# Altium project МПСУ.464421.22-01.PrjPcb (part 1 of 2)
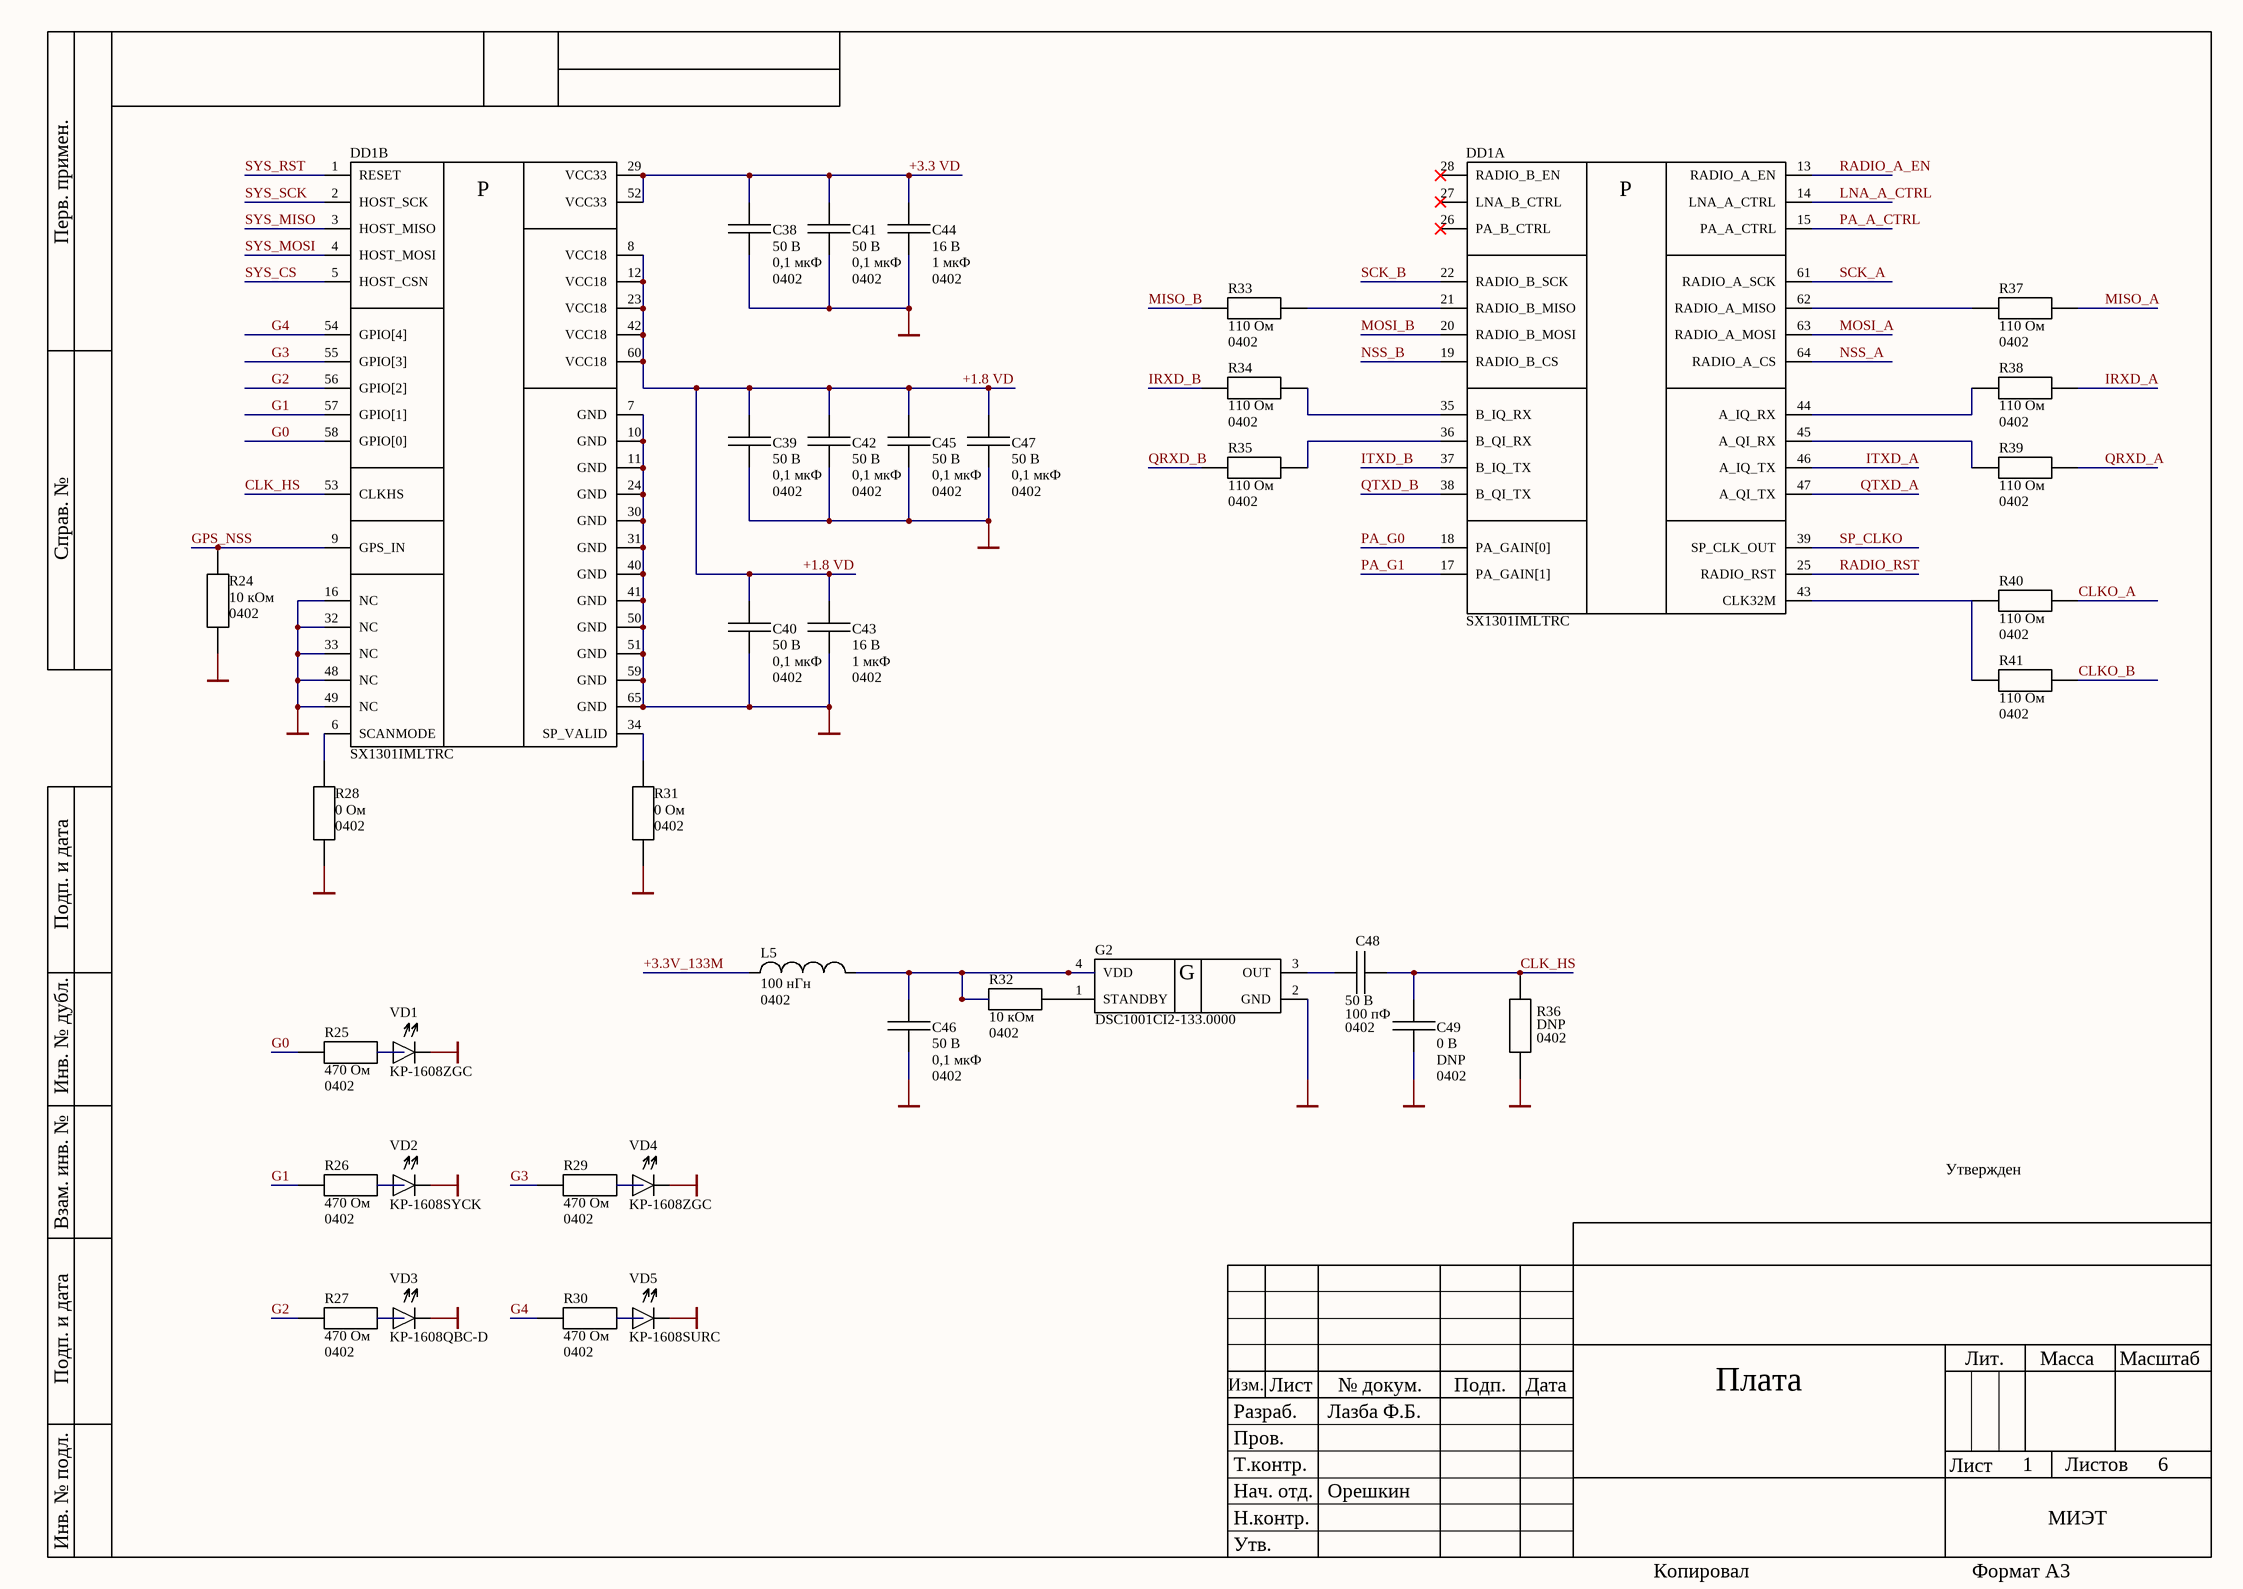
[diagram p0: МПСУ.464421.22-01 BBP.SchDoc]
PCBxIZMxT5M: 00; PCBxObozna4enie: МПСУ.464421.22-01; PCBxTitle: Плата; PCBxTYPExSB: СБ; UZELxObozna4enie: МПСУ.464421.22-01; UZELxPERVxPrimenenie: МПСУ.464421.22-01; UZELxTitle: Плата; Документация0: #МПСУ.464421.22-01#Сборочный чертеж (СБ)#СБ##; Документация1: #МПСУ.464421.22-01#Схема электрическая принципиальная (Э3)#Э3##; Документация2: #МПСУ.464421.22-01#Перечень элементов  (ПЭ3)#ПЭ3##; Документация3: #МПСУ.464421.22-01#Ведомость покупных изделий (ВП)#ВП##; Документация4: #МПСУ.464421.22-01#Плата. Данные проектирования (Д1)#Д1##; Документация5: #МПСУ.464421.22-01#Плата. Данные конструкции (Т5М)#Т5М##; Наименование: Модуль Базовой Станции Приемопередающий; Наименование1: Модуль Базовой Станции; Наименование2: Приемопередающий; Наименование_PCB: Плата; Обозначение: МПСУ.464421.22-01; Обозначение_PCB: МПСУ.758754.22-01; Обозначение_Код: МПСУ.464421.22-01; Перв.Примен.: МПСУ.464421.22-01; ПервПримен: МПСУ.464421.22-01; п_Пров_Р: Орешкин; п_Разраб_Р: Лазба; п_Утв_Р: Орешкин
6 sheets, 211 parts. Net scope: global (net labels, ports and power ports of the same name join across sheets).
Board file: МПСУ.687254.22-01.PcbDoc
Sheets:
  МПСУ.464421.22-01 BBP.SchDoc
  МПСУ.464421.22-01 RF Interface.SchDoc
  МПСУ.464421.22-01 RF_OUT.SchDoc
  МПСУ.464421.22-01 RF_IN.SchDoc
  МПСУ.464421.22-01 Switch,GPS, IO Connectors.SchDoc
  МПСУ.464421.22-01 Power.SchDoc

## Sheet МПСУ.464421.22-01 BBP.SchDoc
size 420 x 297 mm; Author: Лазба Ф.Б.; CompanyName: МИЭТ; DrawnBy: Лазба Ф.Б.; Organization: МИЭТ; Address1: Address1; Address2: Address2; Address3: Address3; Address4: Address4; SheetNumber: 1; SheetTotal: 6; OboznachenieSCH: МПСУ.464421.22-01; DocumentTypeSCH: Э3; NachOtdelaSCH: Орешкин; DocumentName1SCH: Плата; UtverjdenSCH: Утвержден

### Parts
C38  value 0,1 мкФ  Peak_Condition: 50 В  Package: 0402  [CAPC100X50X55L20N]  (hidden comment: 0,1 мкФ ± 10 % 50 В X7R 0402 GRM155R71H104KE14J)
C39  value 0,1 мкФ  Peak_Condition: 50 В  Package: 0402  [CAPC100X50X55L20N]  (hidden comment: 0,1 мкФ ± 10 % 50 В X7R 0402 GRM155R71H104KE14J)
C40  value 0,1 мкФ  Peak_Condition: 50 В  Package: 0402  [CAPC100X50X55L20N]  (hidden comment: 0,1 мкФ ± 10 % 50 В X7R 0402 GRM155R71H104KE14J)
C41  value 0,1 мкФ  Peak_Condition: 50 В  Package: 0402  [CAPC100X50X55L20N]  (hidden comment: 0,1 мкФ ± 10 % 50 В X7R 0402 GRM155R71H104KE14J)
C42  value 0,1 мкФ  Peak_Condition: 50 В  Package: 0402  [CAPC100X50X55L20N]  (hidden comment: 0,1 мкФ ± 10 % 50 В X7R 0402 GRM155R71H104KE14J)
C43  value 1 мкФ  Peak_Condition: 16 В  Package: 0402  [CAPC100X50X55L20N]  (hidden comment: 1 мкФ ± 10 % 16 В X5R 0402 GRM155R61C105KA12D)
C44  value 1 мкФ  Peak_Condition: 16 В  Package: 0402  [CAPC100X50X55L20N]  (hidden comment: 1 мкФ ± 10 % 16 В X5R 0402 GRM155R61C105KA12D)
C45  value 0,1 мкФ  Peak_Condition: 50 В  Package: 0402  [CAPC100X50X55L20N]  (hidden comment: 0,1 мкФ ± 10 % 50 В X7R 0402 GRM155R71H104KE14J)
C46  value 0,1 мкФ  Peak_Condition: 50 В  Package: 0402  [CAPC100X50X55L20N]  (hidden comment: 0,1 мкФ ± 10 % 50 В X7R 0402 GRM155R71H104KE14J)
C47  value 0,1 мкФ  Peak_Condition: 50 В  Package: 0402  [CAPC100X50X55L20N]  (hidden comment: 0,1 мкФ ± 10 % 50 В X7R 0402 GRM155R71H104KE14J)
C48  value 100 пФ  Peak_Condition: 50 В  Package: 0402  [CAPC100X50X55L20N]  (hidden comment: 100 пФ ± 5 % 50 В C0G 0402 GRM1555C1H101JZ01D)
C49  value DNP  Peak_Condition: 0 В  Package: 0402  [CAPC100X50X55L20N]  (hidden comment: DNP 0402)
DD1  SX1301IMLTRC  [SX1301IMLTRC]  (parts A,B of 2)
G2  DSC1001CI2-133.0000  [DSC1001CI2]
L5  value 100 нГн  Package: 0402  [INDC100X50X60L10N]  (hidden comment: 100 нГн ± 5 % 200 мА 0402 LQG15HNR10J02D)
R24  value 10 кОм  Package: 0402  [RESC100X50X40L25N]  (hidden comment: 10 кОм ± 5 % 0 Вт 0402 RI0402L103JT)
R25  value 470 Ом  Package: 0402  [RESC100X50X40L25N]  (hidden comment: 470 Ом ± 5 % 0 Вт 0402 RI0402L471JT)
R26  value 470 Ом  Package: 0402  [RESC100X50X40L25N]  (hidden comment: 470 Ом ± 5 % 0 Вт 0402 RI0402L471JT)
R27  value 470 Ом  Package: 0402  [RESC100X50X40L25N]  (hidden comment: 470 Ом ± 5 % 0 Вт 0402 RI0402L471JT)
R28  value 0 Ом  Package: 0402  [RESC100X50X40L25N]  (hidden comment: 0 Ом ± 5 % 0 Вт 0402 RI0402L000JT)
R29  value 470 Ом  Package: 0402  [RESC100X50X40L25N]  (hidden comment: 470 Ом ± 5 % 0 Вт 0402 RI0402L471JT)
R30  value 470 Ом  Package: 0402  [RESC100X50X40L25N]  (hidden comment: 470 Ом ± 5 % 0 Вт 0402 RI0402L471JT)
R31  value 0 Ом  Package: 0402  [RESC100X50X40L25N]  (hidden comment: 0 Ом ± 5 % 0 Вт 0402 RI0402L000JT)
R32  value 10 кОм  Package: 0402  [RESC100X50X40L25N]  (hidden comment: 10 кОм ± 5 % 0 Вт 0402 RI0402L103JT)
R33  value 110 Ом  Package: 0402  [RESC100X50X40L25N]  (hidden comment: 110 Ом ± 5 % 0 Вт 0402 RC-02U111JT)
R34  value 110 Ом  Package: 0402  [RESC100X50X40L25N]  (hidden comment: 110 Ом ± 5 % 0 Вт 0402 RC-02U111JT)
R35  value 110 Ом  Package: 0402  [RESC100X50X40L25N]  (hidden comment: 110 Ом ± 5 % 0 Вт 0402 RC-02U111JT)
R36  value DNP  Package: 0402  [RESC100X50X40L25N]  (hidden comment: DNP 0402)
R37  value 110 Ом  Package: 0402  [RESC100X50X40L25N]  (hidden comment: 110 Ом ± 5 % 0 Вт 0402 RC-02U111JT)
R38  value 110 Ом  Package: 0402  [RESC100X50X40L25N]  (hidden comment: 110 Ом ± 5 % 0 Вт 0402 RC-02U111JT)
R39  value 110 Ом  Package: 0402  [RESC100X50X40L25N]  (hidden comment: 110 Ом ± 5 % 0 Вт 0402 RC-02U111JT)
R40  value 110 Ом  Package: 0402  [RESC100X50X40L25N]  (hidden comment: 110 Ом ± 5 % 0 Вт 0402 RC-02U111JT)
R41  value 110 Ом  Package: 0402  [RESC100X50X40L25N]  (hidden comment: 110 Ом ± 5 % 0 Вт 0402 RC-02U111JT)
VD1  KP-1608ZGC  [KP-1608ZGC]
VD2  KP-1608SYCK  [KP-1608ZGC]
VD3  KP-1608QBC-D  [KP-1608ZGC]
VD4  KP-1608ZGC  [KP-1608ZGC]
VD5  KP-1608SURC  [KP-1608ZGC]

### Nets
+1.8 VD: C39.1 C40.1 C42.1 C43.1 C45.1 C47.1 DD1.8(VCC18) DD1.12(VCC18) DD1.23(VCC18) DD1.42(VCC18) DD1.60(VCC18)
+3.3 VD: C38.1 C41.1 C44.1 DD1.29(VCC33) DD1.52(VCC33)
+3.3V_133M: L5.1
GND: C38.2 C39.2 C40.2 C41.2 C42.2 C43.2 C44.2 C45.2 C46.2 C47.2 C49.2 DD1.7(GND) DD1.10(GND) DD1.11(GND) DD1.16(NC) DD1.24(GND) DD1.30(GND) DD1.31(GND) DD1.32(NC) DD1.33(NC) DD1.40(GND) DD1.41(GND) DD1.48(NC) DD1.49(NC) DD1.50(GND) DD1.51(GND) DD1.59(GND) DD1.65(GND) G2.2(GND) R24.1 R28.1 R31.1 R36.2 VD1.2 VD2.2 VD3.2 VD4.2 VD5.2
CLK_HS: C48.2 C49.1 DD1.53(CLKHS) R36.1
CLKO_A: R40.2
CLKO_B: R41.2
G0: DD1.58(GPIO[0]) R25.1
G1: DD1.57(GPIO[1]) R26.1
G2: DD1.56(GPIO[2]) R27.1
G3: DD1.55(GPIO[3]) R29.1
G4: DD1.54(GPIO[4]) R30.1
GPS_NSS: DD1.9(GPS_IN) R24.2
IRXD_A: R38.2
IRXD_B: R34.1
ITXD_A: DD1.46(A_IQ_TX)
ITXD_B: DD1.37(B_IQ_TX)
LNA_A_CTRL: DD1.14(LNA_A_CTRL)
MISO_A: R37.2
MISO_B: R33.1
MOSI_A: DD1.63(RADIO_A_MOSI)
MOSI_B: DD1.20(RADIO_B_MOSI)
NSS_A: DD1.64(RADIO_A_CS)
NSS_B: DD1.19(RADIO_B_CS)
PA_A_CTRL: DD1.15(PA_A_CTRL)
PA_G0: DD1.18(PA_GAIN[0])
PA_G1: DD1.17(PA_GAIN[1])
QRXD_A: R39.2
QRXD_B: R35.1
QTXD_A: DD1.47(A_QI_TX)
QTXD_B: DD1.38(B_QI_TX)
RADIO_A_EN: DD1.13(RADIO_A_EN)
RADIO_RST: DD1.25(RADIO_RST)
SCK_A: DD1.61(RADIO_A_SCK)
SCK_B: DD1.22(RADIO_B_SCK)
SP_CLKO: DD1.39(SP_CLK_OUT)
SYS_CS: DD1.5(HOST_CSN)
SYS_MISO: DD1.3(HOST_MISO)
SYS_MOSI: DD1.4(HOST_MOSI)
SYS_RST: DD1.1(RESET)
SYS_SCK: DD1.2(HOST_SCK)
NetC46_1: C46.1 G2.4(VDD) L5.2 R32.1
NetC48_1: C48.1 G2.3(OUT)
NetDD1_6: DD1.6(SCANMODE) R28.2
NetDD1_21: DD1.21(RADIO_B_MISO) R33.2
NetDD1_34: DD1.34(SP_VALID) R31.2
NetDD1_35: DD1.35(B_IQ_RX) R34.2
NetDD1_36: DD1.36(B_QI_RX) R35.2
NetDD1_43: DD1.43(CLK32M) R40.1 R41.1
NetDD1_44: DD1.44(A_IQ_RX) R38.1
NetDD1_45: DD1.45(A_QI_RX) R39.1
NetDD1_62: DD1.62(RADIO_A_MISO) R37.1
NetG2_1: G2.1(STANDBY) R32.2
NetR25_2: R25.2 VD1.1
NetR26_2: R26.2 VD2.1
NetR27_2: R27.2 VD3.1
NetR29_2: R29.2 VD4.1
NetR30_2: R30.2 VD5.1

Not connected (* = marked no-connect by the designer): DD1 26(PA_B_CTRL)* 27(LNA_B_CTRL)* 28(RADIO_B_EN)*

### Notes on the sheet
- Перв. примен.
- Справ. №
- Подп. и дата
- Инв. № дубл.
- Взам. инв. №
- Разраб.
- Изм.
- Лист
- № докум.
- Подп.
- Дата
- Лит.
- Масса
- Масштаб
- Пров.
- Т.контр.
- Листов
- Инв. № подл.
- Утв.
- Н.контр.
- Нач. отд.
- Копировал
- Формат А3
- (in symbol DSC1001/3/4***-***.****) G
- (in symbol SX1301IMLTRC, part A) P
- (in symbol SX1301IMLTRC, part B) P

### Library data of the parts
C38-C47 = C 0402: Capacitor 0402; Manufacturer: Murata; Tolerance: 10 %; Designer: Свидерский; 3D_Body: +; Category: Passive; Subcategory: Capacitor; Status: Approved
  C38-C42 C45-C47: PartNumber: GRM155R71H104KE14J; Dielectric: X7R
  C43 C44: PartNumber: GRM155R61C105KA12D; Dielectric: X5R
C48 = C 0402: Capacitor 0402; Manufacturer: Murata; Tolerance: 5 %; Designer: Свидерский; 3D_Body: +; PartNumber: GRM1555C1H101JZ01D; Category: Passive; Subcategory: Capacitor; Dielectric: C0G; Status: Approved
C49 = C 0402: Capacitor 0402; Tolerance: 0 %; Designer: Свидерский; Notes: CP; 3D_Body: +; Category: Passive; Subcategory: Capacitor; Status: Approved
DD1 = SX1301IMLTRC: LoRa Core™ Digital Baseband Chip for outdoor LoRaWAN® network macro gateways; Manufacturer: Semtech; Designer: Лазба; 3D_Body: +; ComponentLink1Description: Техническое описание; ComponentLink1URL: Q:\Libs\Descriptions_PDF\DS_SX1301_V2_4_W.pdf; Category: IC; Subcategory: BPP; Status: Check; Package: QFN64; PartNumber: SX1301IMLTRC
G2 = DSC1001/3/4***-***.****: 1.8V-3.3V Low-Power Precision CMOS Oscillators 1-150 MHz Family; Manufacturer: Microchip; Designer: Лазба; 3D_Body: +; ComponentLink1Description: Техническое описание; ComponentLink1URL: Q:\Libs\Descriptions_PDF\DSC1001-3-4\DSC1001-3-4.pdf; Category: IC; Subcategory: Crystal Oscillator; Status: Check; Package: *; ComponentLink2Description: Техническое описание 2; ComponentLink2URL: Q:\Libs\Descriptions_PDF\DSC1001-3-4\DSC1001.pdf; PartNumber: DSC1001CI2-133.0000
L5 = L 0402: Inductor 0402; Manufacturer: Murata; Designer: Свидерский; 3D_Body: +; Tolerance: 5 %; Peak_Condition: 200 мА; PartNumber: LQG15HNR10J02D; Category: Passive; Subcategory: Inductor; Status: Approved
R24-R32 = R 0402: Resistor 0402; Manufacturer: Hottech; Designer: Свидерский; 3D_Body: +; Tolerance: 5 %; Peak_Condition: 0 Вт; Category: Passive; Subcategory: Resistor; Status: Approved
  R24 R32: PartNumber: RI0402L103JT
  R25-R27 R29 R30: PartNumber: RI0402L471JT
  R28 R31: PartNumber: RI0402L000JT
R33-R35 R37-R41 = R 0402: Resistor 0402; Manufacturer: Fenghua; Designer: Свидерский; 3D_Body: +; Tolerance: 5 %; Peak_Condition: 0 Вт; PartNumber: RC-02U111JT; Category: Passive; Subcategory: Resistor; Status: Approved
R36 = R 0402: Resistor 0402; Designer: Свидерский; Notes: CP; 3D_Body: +; Tolerance: 0 %; Peak_Condition: 0 Вт; Category: Passive; Subcategory: Resistor; Status: Approved
VD1-VD5 = KP-1608***: 1.6X0.8mm SMD CHIP LED LAMP; Manufacturer: Kingbright; 3D_Body: +; Designer: Ушакова; Category: Discrete; ComponentLink1Description: Техническое описание; ComponentLink1URL: Q:\Libs\Descriptions_PDF\KP-1608ZGC.pdf; Package: 1.6mmX0.8mm SMD LED; Status: Approved; Subcategory: Diode
  VD1 VD4: PartNumber: KP-1608ZGC
  VD2: PartNumber: KP-1608SYCK
  VD3: PartNumber: KP-1608QBC-D
  VD5: PartNumber: KP-1608SURC

## Sheet МПСУ.464421.22-01 RF Interface.SchDoc
size 420 x 297 mm; ApprovedBy: Орешкин; Author: Лазба; DrawnBy: Лазба; Engineer: Лазба; Organization: МИЭТ; Address1: Address1; Address2: Address2; Address3: Address3; Address4: Address4; SheetNumber: 2; SheetTotal: 6; DocumentName1SCH: Плата; DocumentName2SCH: Схема электрическая; DocumentName3SCH: принципиальная; UtverjdenNumberSCH: МПСУ.464421.221; PervichnoePrimenenieSCH: МПСУ.464421.22-01; UtverjdenSCH: Утвержден; DocumentTypeSCH: Э3; OboznachenieSCH: МПСУ.464421.22-01; NachOtdelaSCH: Орешкин
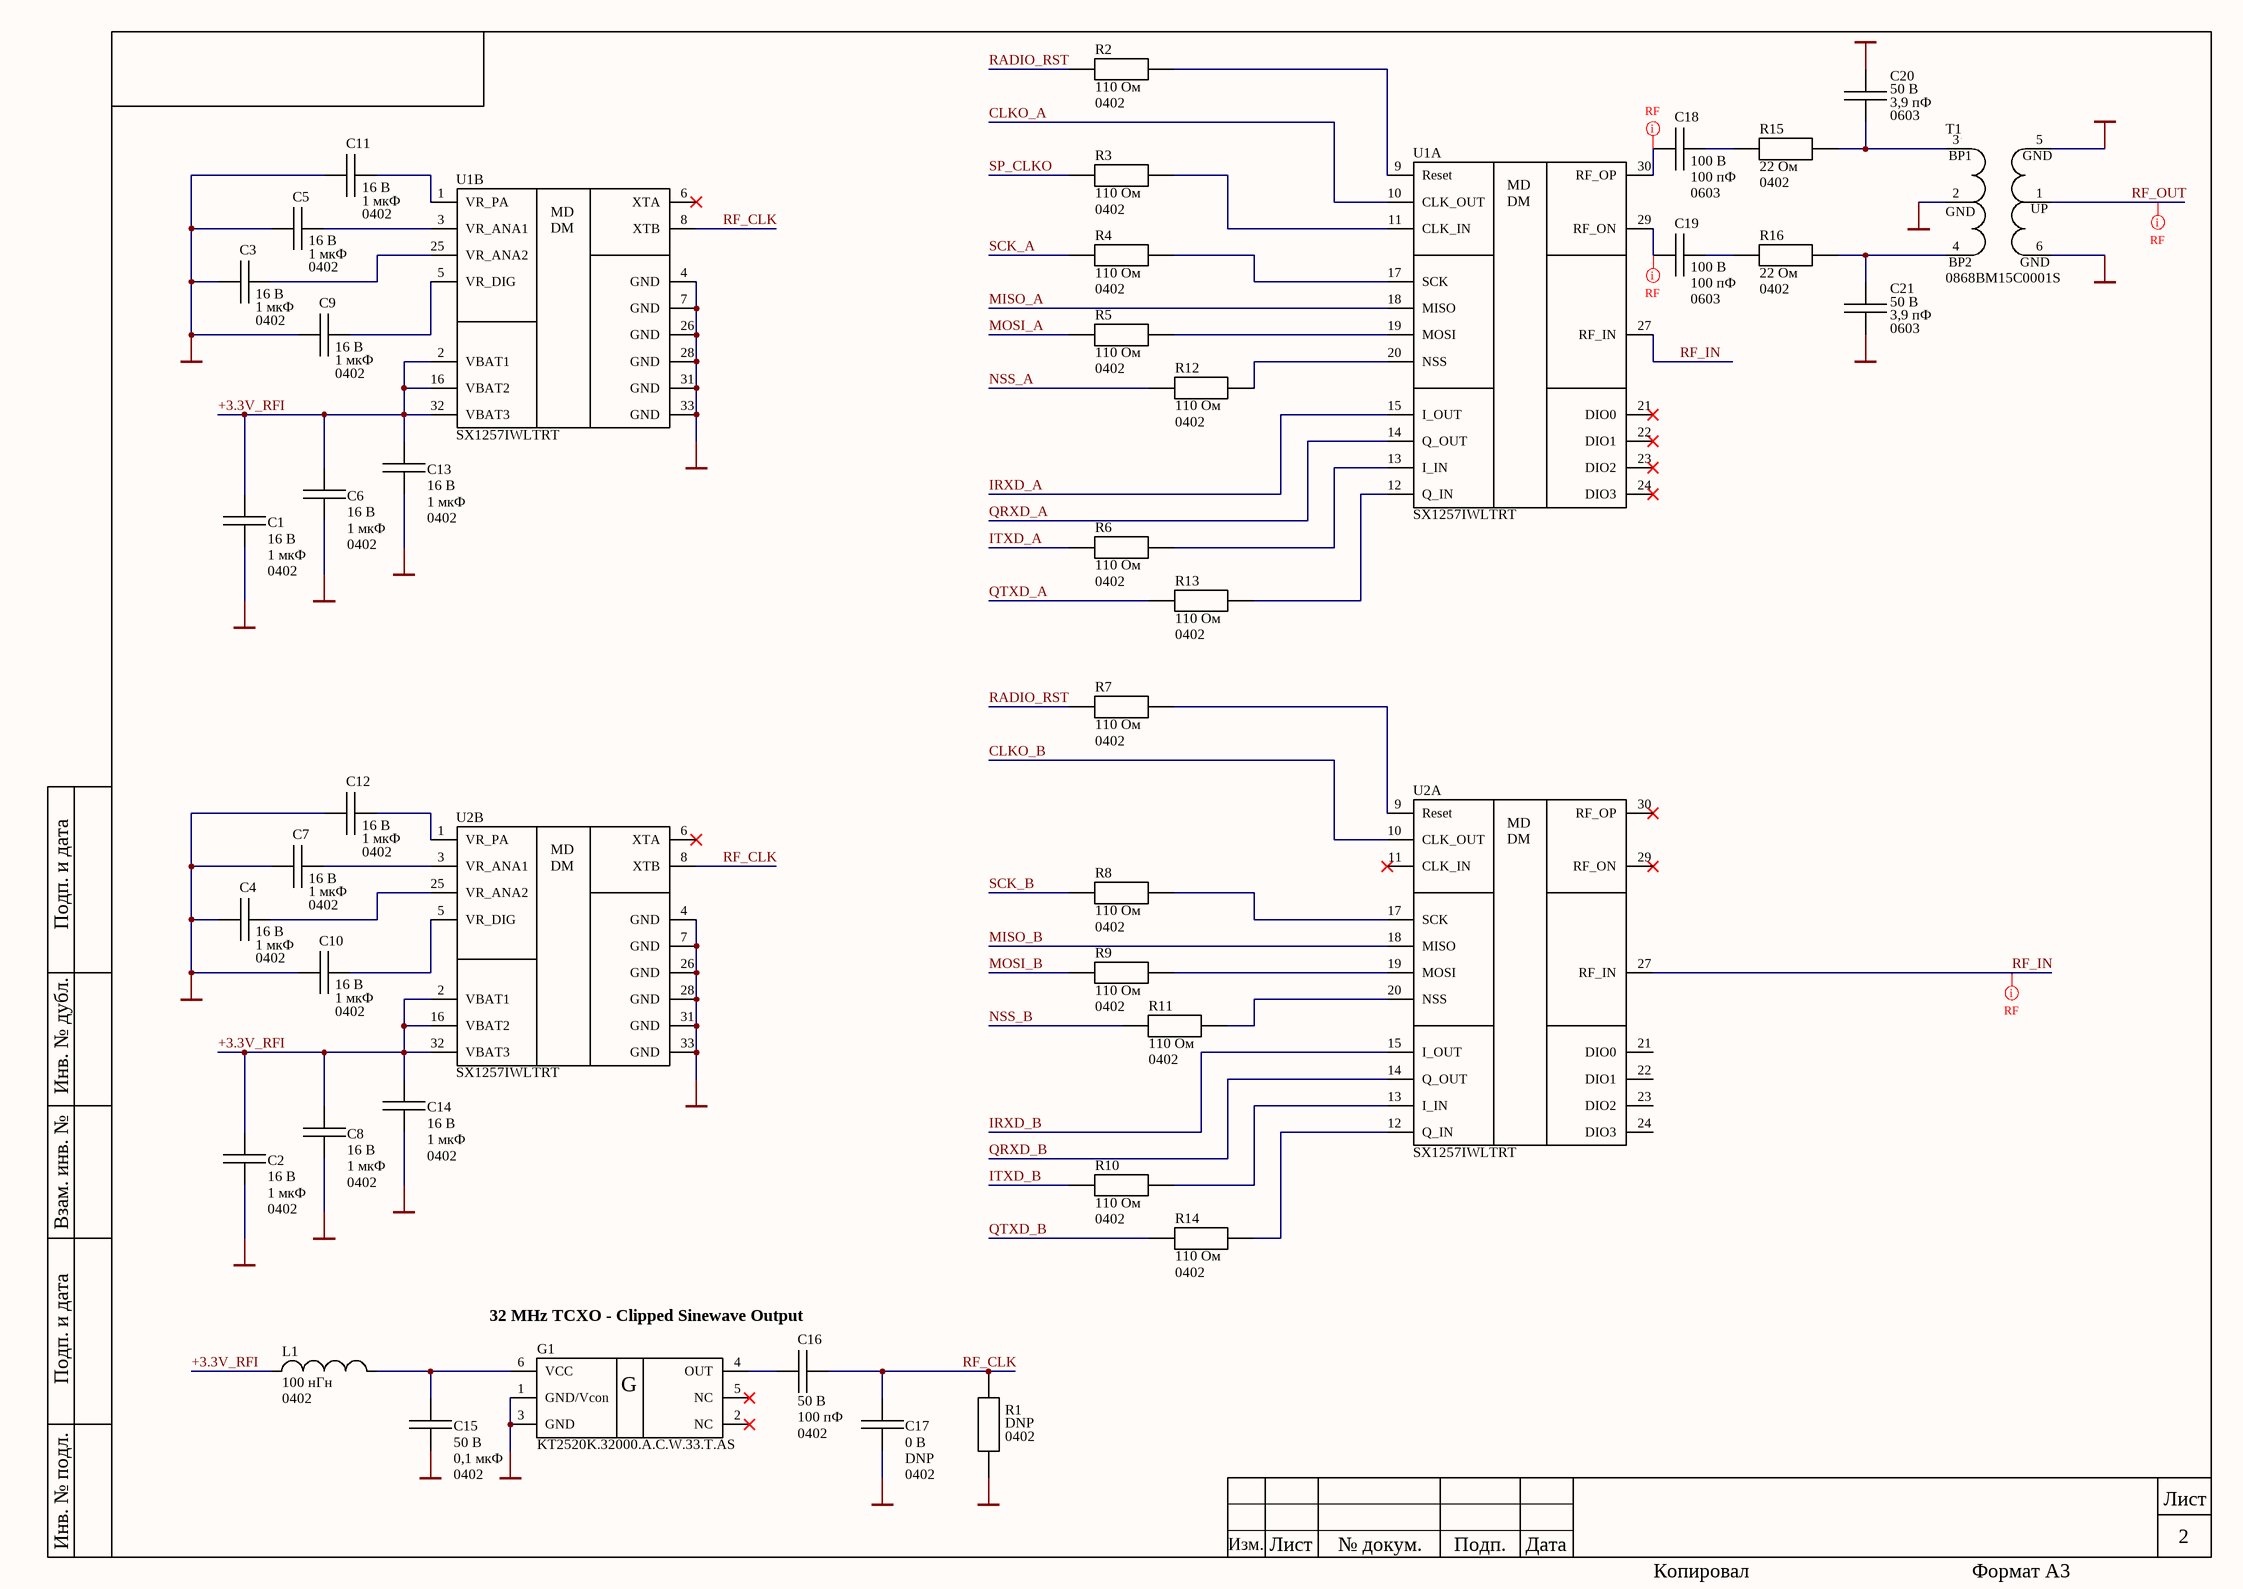
[diagram p1: МПСУ.464421.22-01 RF Interface.SchDoc]

### Parts
C1  value 1 мкФ  Peak_Condition: 16 В  Package: 0402  [CAPC100X50X55L20N]  (hidden comment: 1 мкФ ± 10 % 16 В X5R 0402 GRM155R61C105KA12D)
C2  value 1 мкФ  Peak_Condition: 16 В  Package: 0402  [CAPC100X50X55L20N]  (hidden comment: 1 мкФ ± 10 % 16 В X5R 0402 GRM155R61C105KA12D)
C3  value 1 мкФ  Peak_Condition: 16 В  Package: 0402  [CAPC100X50X55L20N]  (hidden comment: 1 мкФ ± 10 % 16 В X5R 0402 GRM155R61C105KA12D)
C4  value 1 мкФ  Peak_Condition: 16 В  Package: 0402  [CAPC100X50X55L20N]  (hidden comment: 1 мкФ ± 10 % 16 В X5R 0402 GRM155R61C105KA12D)
C5  value 1 мкФ  Peak_Condition: 16 В  Package: 0402  [CAPC100X50X55L20N]  (hidden comment: 1 мкФ ± 10 % 16 В X5R 0402 GRM155R61C105KA12D)
C6  value 1 мкФ  Peak_Condition: 16 В  Package: 0402  [CAPC100X50X55L20N]  (hidden comment: 1 мкФ ± 10 % 16 В X5R 0402 GRM155R61C105KA12D)
C7  value 1 мкФ  Peak_Condition: 16 В  Package: 0402  [CAPC100X50X55L20N]  (hidden comment: 1 мкФ ± 10 % 16 В X5R 0402 GRM155R61C105KA12D)
C8  value 1 мкФ  Peak_Condition: 16 В  Package: 0402  [CAPC100X50X55L20N]  (hidden comment: 1 мкФ ± 10 % 16 В X5R 0402 GRM155R61C105KA12D)
C9  value 1 мкФ  Peak_Condition: 16 В  Package: 0402  [CAPC100X50X55L20N]  (hidden comment: 1 мкФ ± 10 % 16 В X5R 0402 GRM155R61C105KA12D)
C10  value 1 мкФ  Peak_Condition: 16 В  Package: 0402  [CAPC100X50X55L20N]  (hidden comment: 1 мкФ ± 10 % 16 В X5R 0402 GRM155R61C105KA12D)
C11  value 1 мкФ  Peak_Condition: 16 В  Package: 0402  [CAPC100X50X55L20N]  (hidden comment: 1 мкФ ± 10 % 16 В X5R 0402 GRM155R61C105KA12D)
C12  value 1 мкФ  Peak_Condition: 16 В  Package: 0402  [CAPC100X50X55L20N]  (hidden comment: 1 мкФ ± 10 % 16 В X5R 0402 GRM155R61C105KA12D)
C13  value 1 мкФ  Peak_Condition: 16 В  Package: 0402  [CAPC100X50X55L20N]  (hidden comment: 1 мкФ ± 10 % 16 В X5R 0402 GRM155R61C105KA12D)
C14  value 1 мкФ  Peak_Condition: 16 В  Package: 0402  [CAPC100X50X55L20N]  (hidden comment: 1 мкФ ± 10 % 16 В X5R 0402 GRM155R61C105KA12D)
C15  value 0,1 мкФ  Peak_Condition: 50 В  Package: 0402  [CAPC100X50X55L20N]  (hidden comment: 0,1 мкФ ± 10 % 50 В X7R 0402 GRM155R71H104KE14J)
C16  value 100 пФ  Peak_Condition: 50 В  Package: 0402  [CAPC100X50X55L20N]  (hidden comment: 100 пФ ± 5 % 50 В C0G 0402 GRM1555C1H101JZ01D)
C17  value DNP  Peak_Condition: 0 В  Package: 0402  [CAPC100X50X55L20N]  (hidden comment: DNP 0402)
C18  value 100 пФ  Peak_Condition: 100 В  Package: 0603  [CAPC160X80X90L30N]  (hidden comment: 100 пФ ± 1 % 100 В C0G 0603 GRM1885C2A101FA01D)
C19  value 100 пФ  Peak_Condition: 100 В  Package: 0603  [CAPC160X80X90L30N]  (hidden comment: 100 пФ ± 1 % 100 В C0G 0603 GRM1885C2A101FA01D)
C20  value 3,9 пФ  Peak_Condition: 50 В  Package: 0603  [CAPC160X80X90L30N]  (hidden comment: 3,9 пФ ± 0,25 пФ 50 В C0G 0603 GRM1885C1H3R9CZ01D)
C21  value 3,9 пФ  Peak_Condition: 50 В  Package: 0603  [CAPC160X80X90L30N]  (hidden comment: 3,9 пФ ± 0,25 пФ 50 В C0G 0603 GRM1885C1H3R9CZ01D)
G1  KT2520K.32000.A.C.W.33.T.AS  [KT2520K]
L1  value 100 нГн  Package: 0402  [INDC100X50X60L10N]  (hidden comment: 100 нГн ± 5 % 200 мА 0402 LQG15HNR10J02D)
R1  value DNP  Package: 0402  [RESC100X50X40L25N]  (hidden comment: DNP 0402)
R2  value 110 Ом  Package: 0402  [RESC100X50X40L25N]  (hidden comment: 110 Ом ± 5 % 0 Вт 0402 RC-02U111JT)
R3  value 110 Ом  Package: 0402  [RESC100X50X40L25N]  (hidden comment: 110 Ом ± 5 % 0 Вт 0402 RC-02U111JT)
R4  value 110 Ом  Package: 0402  [RESC100X50X40L25N]  (hidden comment: 110 Ом ± 5 % 0 Вт 0402 RC-02U111JT)
R5  value 110 Ом  Package: 0402  [RESC100X50X40L25N]  (hidden comment: 110 Ом ± 5 % 0 Вт 0402 RC-02U111JT)
R6  value 110 Ом  Package: 0402  [RESC100X50X40L25N]  (hidden comment: 110 Ом ± 5 % 0 Вт 0402 RC-02U111JT)
R7  value 110 Ом  Package: 0402  [RESC100X50X40L25N]  (hidden comment: 110 Ом ± 5 % 0 Вт 0402 RC-02U111JT)
R8  value 110 Ом  Package: 0402  [RESC100X50X40L25N]  (hidden comment: 110 Ом ± 5 % 0 Вт 0402 RC-02U111JT)
R9  value 110 Ом  Package: 0402  [RESC100X50X40L25N]  (hidden comment: 110 Ом ± 5 % 0 Вт 0402 RC-02U111JT)
R10  value 110 Ом  Package: 0402  [RESC100X50X40L25N]  (hidden comment: 110 Ом ± 5 % 0 Вт 0402 RC-02U111JT)
R11  value 110 Ом  Package: 0402  [RESC100X50X40L25N]  (hidden comment: 110 Ом ± 5 % 0 Вт 0402 RC-02U111JT)
R12  value 110 Ом  Package: 0402  [RESC100X50X40L25N]  (hidden comment: 110 Ом ± 5 % 0 Вт 0402 RC-02U111JT)
R13  value 110 Ом  Package: 0402  [RESC100X50X40L25N]  (hidden comment: 110 Ом ± 5 % 0 Вт 0402 RC-02U111JT)
R14  value 110 Ом  Package: 0402  [RESC100X50X40L25N]  (hidden comment: 110 Ом ± 5 % 0 Вт 0402 RC-02U111JT)
R15  value 22 Ом  Package: 0402  [RESC100X50X40L25N]  (hidden comment: 22 Ом ± 1 % 0 Вт 0402 RC0402FR-0722RL)
R16  value 22 Ом  Package: 0402  [RESC100X50X40L25N]  (hidden comment: 22 Ом ± 1 % 0 Вт 0402 RC0402FR-0722RL)
T1  0868BM15C0001S  [LCC065P125X200X085-6]
U1  SX1257IWLTRT  [SX1257IWLTRT]  (parts A,B of 2)
U2  SX1257IWLTRT  [SX1257IWLTRT]  (parts A,B of 2)

### Nets
+3.3V_RFI: C1.2 C2.2 C6.2 C8.2 C13.2 C14.2 L1.1 U1.2(VBAT1) U1.16(VBAT2) U1.32(VBAT3) U2.2(VBAT1) U2.16(VBAT2) U2.32(VBAT3)  [project net +3.3V_133M]
GND: C1.1 C2.1 C3.2 C4.2 C5.2 C6.1 C7.2 C8.1 C9.2 C10.2 C11.2 C12.2 C13.1 C14.1 C15.2 C17.2 C20.1 C21.2 G1.1(GND/Vcon) G1.3(GND) R1.2 T1.2(GND) T1.5(GND) T1.6(GND) U1.4(GND) U1.7(GND) U1.26(GND) U1.28(GND) U1.31(GND) U1.33(GND) U2.4(GND) U2.7(GND) U2.26(GND) U2.28(GND) U2.31(GND) U2.33(GND)
CLKO_A: U1.10(CLK_OUT)
CLKO_B: U2.10(CLK_OUT)
IRXD_A: U1.15(I_OUT)
IRXD_B: U2.15(I_OUT)
ITXD_A: R6.1
ITXD_B: R10.1
MISO_A: U1.18(MISO)
MISO_B: U2.18(MISO)
MOSI_A: R5.1
MOSI_B: R9.1
NSS_A: R12.1
NSS_B: R11.1
QRXD_A: U1.14(Q_OUT)
QRXD_B: U2.14(Q_OUT)
QTXD_A: R13.1
QTXD_B: R14.1
RADIO_RST: R2.1 R7.1
RF_CLK: C16.2 C17.1 R1.1 U1.8(XTB) U2.8(XTB)
RF_IN: U1.27(RF_IN) U2.27(RF_IN)
RF_OUT: T1.1(UP)
SCK_A: R4.1
SCK_B: R8.1
SP_CLKO: R3.1
NetC3_1: C3.1 U1.25(VR_ANA2)
NetC4_1: C4.1 U2.25(VR_ANA2)
NetC5_1: C5.1 U1.3(VR_ANA1)
NetC7_1: C7.1 U2.3(VR_ANA1)
NetC9_1: C9.1 U1.5(VR_DIG)
NetC10_1: C10.1 U2.5(VR_DIG)
NetC11_1: C11.1 U1.1(VR_PA)
NetC12_1: C12.1 U2.1(VR_PA)
NetC15_1: C15.1 G1.6(VCC) L1.2
NetC16_1: C16.1 G1.4(OUT)
NetC18_1: C18.1 U1.30(RF_OP)
NetC18_2: C18.2 R15.1
NetC19_1: C19.1 U1.29(RF_ON)
NetC19_2: C19.2 R16.1
NetC20_2: C20.2 R15.2 T1.3(BP1)
NetC21_1: C21.1 R16.2 T1.4(BP2)
NetR2_2: R2.2 U1.9(Reset)
NetR3_2: R3.2 U1.11(CLK_IN)
NetR4_2: R4.2 U1.17(SCK)
NetR5_2: R5.2 U1.19(MOSI)
NetR6_2: R6.2 U1.13(I_IN)
NetR7_2: R7.2 U2.9(Reset)
NetR8_2: R8.2 U2.17(SCK)
NetR9_2: R9.2 U2.19(MOSI)
NetR10_2: R10.2 U2.13(I_IN)
NetR11_2: R11.2 U2.20(NSS)
NetR12_2: R12.2 U1.20(NSS)
NetR13_2: R13.2 U1.12(Q_IN)
NetR14_2: R14.2 U2.12(Q_IN)

Not connected (* = marked no-connect by the designer): G1 2(NC)* 5(NC)*; U1 6(XTA)* 21(DIO0)* 22(DIO1)* 23(DIO2)* 24(DIO3)*; U2 6(XTA)* 11(CLK_IN)* 21(DIO0) 22(DIO1) 23(DIO2) 24(DIO3) 29(RF_ON)* 30(RF_OP)*

### Layout directives
net class RF: NetC18_1, NetC19_1, RF_IN, RF_OUT

### Notes on the sheet
- 32 MHz TCXO - Clipped Sinewave Output
- Подп. и дата
- Инв. № дубл.
- Взам. инв. №
- Инв. № подл.
- Изм.
- Лист
- № докум.
- Подп.
- Дата
- Копировал
- Формат А3
- (in symbol KT2520K.*****.*.*.*.**.*.*) G
- (in symbol SX1257IWLTRT, part A) MD / DM
- (in symbol SX1257IWLTRT, part B) MD / DM

### Library data of the parts
C1-C15 = C 0402: as C38 on sheet МПСУ.464421.22-01 BBP; Category: Passive; Subcategory: Capacitor; Status: Approved
  C1-C14: PartNumber: GRM155R61C105KA12D; Dielectric: X5R
  C15: PartNumber: GRM155R71H104KE14J; Dielectric: X7R
C16 = C 0402: as C48 on sheet МПСУ.464421.22-01 BBP; PartNumber: GRM1555C1H101JZ01D; Category: Passive; Subcategory: Capacitor; Dielectric: C0G; Status: Approved
C17 = C 0402: as C49 on sheet МПСУ.464421.22-01 BBP; Category: Passive; Subcategory: Capacitor; Status: Approved
C18 C19 = C 0603: Capacitor 0603; Manufacturer: Murata; Tolerance: 1 %; Designer: Свидерский; 3D_Body: +; PartNumber: GRM1885C2A101FA01D; Category: Passive; Subcategory: Capacitor; Dielectric: C0G; Status: Approved
C20 C21 = C 0603: Capacitor 0603; Manufacturer: Murata; Tolerance: 0,25 пФ; Designer: Свидерский; 3D_Body: +; PartNumber: GRM1885C1H3R9CZ01D; Category: Passive; Subcategory: Capacitor; Dielectric: C0G; Status: Approved
G1 = KT2520K.*****.*.*.*.**.*.*: Temperature Compensated Crystal Oscillators (TCXO, VCTCXO) Surface Mount Type; Manufacturer: Kyocera; Designer: Лазба; 3D_Body: +; Standard Freq, MHz: 19.2, 26, 32, 38.4, 48, 52; ComponentLink1Description: Техническое описание; ComponentLink1URL: Q:\Libs\Descriptions_PDF\kt2520_e.pdf; Category: IC; Subcategory: Crystal Oscillator; Status: Check; Package: Miniature SMD type (2.5×2.0×0.8mm); PartNumber: KT2520K.32000.A.C.W.33.T.AS
L1 = L 0402: as L5 on sheet МПСУ.464421.22-01 BBP; PartNumber: LQG15HNR10J02D; Category: Passive; Subcategory: Inductor; Status: Approved
R1 = R 0402: as R36 on sheet МПСУ.464421.22-01 BBP; Category: Passive; Subcategory: Resistor; Status: Approved
R2-R14 = R 0402: as R33 on sheet МПСУ.464421.22-01 BBP; PartNumber: RC-02U111JT; Category: Passive; Subcategory: Resistor; Status: Approved
R15 R16 = R 0402: Resistor 0402; Manufacturer: Thunder; Designer: Свидерский; 3D_Body: +; Tolerance: 1 %; Peak_Condition: 0 Вт; PartNumber: RC0402FR-0722RL; Category: Passive; Subcategory: Resistor; Status: Approved
T1 = 0868BM15C0001*: 868MHz Center Frequency Balun/Filter for high frequency ceramic solutions 10MHz Bandwidth 0.5dB 0805 (2012 Metric), 8 PC Pad; Manufacturer: Johanson Technology Inc.; Designer: Лазба; 3D_Body: +; ComponentLink1Description: Техническое описание; ComponentLink1URL: Q:\Libs\Descriptions_PDF\0868BM15C0001.pdf; Category: Passive; Subcategory: Filter; Status: Check; PartNumber: 0868BM15C0001S
U1 U2 = SX1257IWLTRT: LoRa Core™ Low Power Digital I and Q RF Multi-PHY Mode Analog Front End 860-1000MHz; Manufacturer: Semtech; Designer: Лазба; 3D_Body: +; ComponentLink1Description: Техническое описание; ComponentLink1URL: Q:\Libs\Descriptions_PDF\DS_SX1257_V1.2.pdf; Category: IC; Subcategory: Transciever; Status: Check; Package: QFN32; PartNumber: SX1257IWLTRT

## Sheet МПСУ.464421.22-01 RF_OUT.SchDoc
size 420 x 297 mm; Address1: Address1; Address2: Address2; Address3: Address3; Address4: Address4; SheetNumber: 3; SheetTotal: 6; OboznachenieSCH: МПСУ.464421.22-01; DocumentTypeSCH: Э3; DocumentName1SCH: Плата; NachOtdelaSCH: Орешкин; UtverjdenSCH: Утвержден
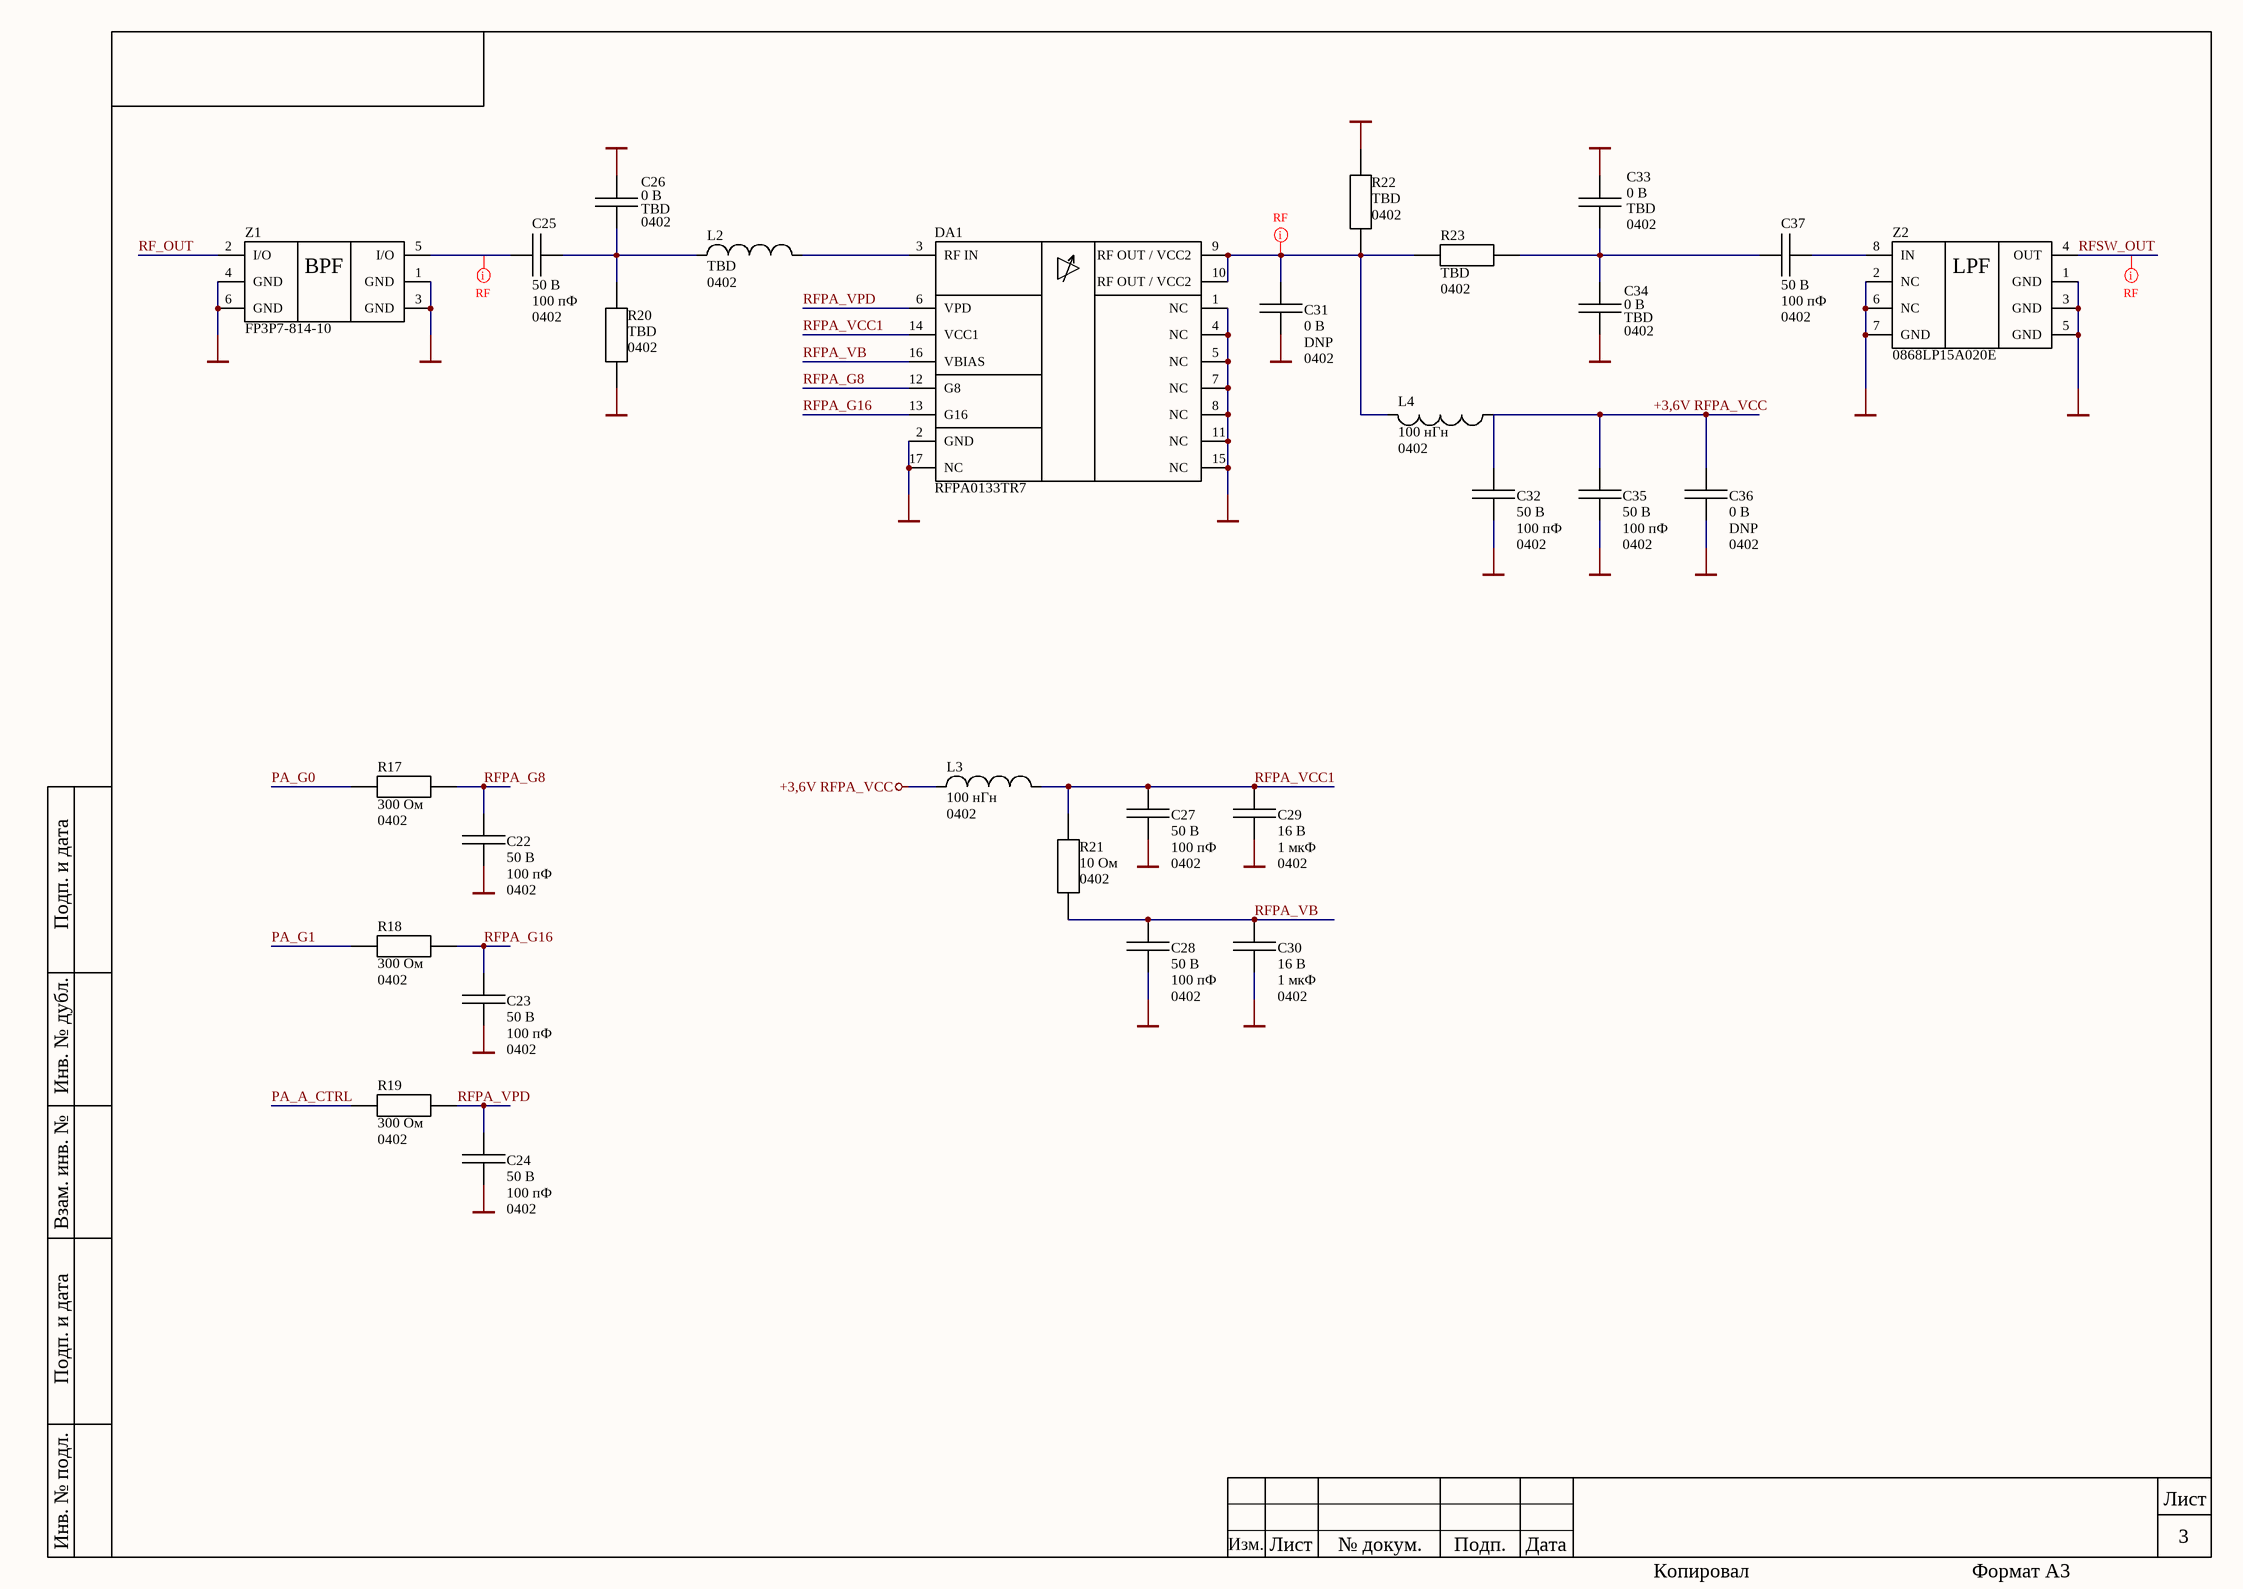
[diagram p2: МПСУ.464421.22-01 RF_OUT.SchDoc]

### Parts
C22  value 100 пФ  Peak_Condition: 50 В  Package: 0402  [CAPC100X50X55L20N]  (hidden comment: 100 пФ ± 5 % 50 В C0G 0402 GRM1555C1H101JZ01D)
C23  value 100 пФ  Peak_Condition: 50 В  Package: 0402  [CAPC100X50X55L20N]  (hidden comment: 100 пФ ± 5 % 50 В C0G 0402 GRM1555C1H101JZ01D)
C24  value 100 пФ  Peak_Condition: 50 В  Package: 0402  [CAPC100X50X55L20N]  (hidden comment: 100 пФ ± 5 % 50 В C0G 0402 GRM1555C1H101JZ01D)
C25  value 100 пФ  Peak_Condition: 50 В  Package: 0402  [CAPC100X50X55L20N]  (hidden comment: 100 пФ ± 5 % 50 В C0G 0402 GRM1555C1H101JZ01D)
C26  value TBD  Peak_Condition: 0 В  Package: 0402  [CAPC100X50X55L20N]  (hidden comment: TBD 0402)
C27  value 100 пФ  Peak_Condition: 50 В  Package: 0402  [CAPC100X50X55L20N]  (hidden comment: 100 пФ ± 5 % 50 В C0G 0402 GRM1555C1H101JZ01D)
C28  value 100 пФ  Peak_Condition: 50 В  Package: 0402  [CAPC100X50X55L20N]  (hidden comment: 100 пФ ± 5 % 50 В C0G 0402 GRM1555C1H101JZ01D)
C29  value 1 мкФ  Peak_Condition: 16 В  Package: 0402  [CAPC100X50X55L20N]  (hidden comment: 1 мкФ ± 10 % 16 В X5R 0402 GRM155R61C105KA12D)
C30  value 1 мкФ  Peak_Condition: 16 В  Package: 0402  [CAPC100X50X55L20N]  (hidden comment: 1 мкФ ± 10 % 16 В X5R 0402 GRM155R61C105KA12D)
C31  value DNP  Peak_Condition: 0 В  Package: 0402  [CAPC100X50X55L20N]  (hidden comment: DNP 0402)
C32  value 100 пФ  Peak_Condition: 50 В  Package: 0402  [CAPC100X50X55L20N]  (hidden comment: 100 пФ ± 5 % 50 В C0G 0402 GRM1555C1H101JZ01D)
C33  value TBD  Peak_Condition: 0 В  Package: 0402  [CAPC100X50X55L20N]  (hidden comment: TBD 0402)
C34  value TBD  Peak_Condition: 0 В  Package: 0402  [CAPC100X50X55L20N]  (hidden comment: TBD 0402)
C35  value 100 пФ  Peak_Condition: 50 В  Package: 0402  [CAPC100X50X55L20N]  (hidden comment: 100 пФ ± 5 % 50 В C0G 0402 GRM1555C1H101JZ01D)
C36  value DNP  Peak_Condition: 0 В  Package: 0402  [CAPC100X50X55L20N]  (hidden comment: DNP 0402)
C37  value 100 пФ  Peak_Condition: 50 В  Package: 0402  [CAPC100X50X55L20N]  (hidden comment: 100 пФ ± 5 % 50 В C0G 0402 GRM1555C1H101JZ01D)
DA1  RFPA0133TR7  [QFN50P300X300X90_HS-17N]
L2  value TBD  Package: 0402  [INDC100X50X60L10N]  (hidden comment: TBD 0402)
L3  value 100 нГн  Package: 0402  [INDC100X50X60L10N]  (hidden comment: 100 нГн ± 5 % 200 мА 0402 LQG15HNR10J02D)
L4  value 100 нГн  Package: 0402  [INDC100X50X60L10N]  (hidden comment: 100 нГн ± 5 % 200 мА 0402 LQG15HNR10J02D)
R17  value 300 Ом  Package: 0402  [RESC100X50X40L25N]  (hidden comment: 300 Ом ± 5 % 0 Вт 0402 RI0402L301JT)
R18  value 300 Ом  Package: 0402  [RESC100X50X40L25N]  (hidden comment: 300 Ом ± 5 % 0 Вт 0402 RI0402L301JT)
R19  value 300 Ом  Package: 0402  [RESC100X50X40L25N]  (hidden comment: 300 Ом ± 5 % 0 Вт 0402 RI0402L301JT)
R20  value TBD  Package: 0402  [RESC100X50X40L25N]  (hidden comment: TBD 0402)
R21  value 10 Ом  Package: 0402  [RESC100X50X40L25N]  (hidden comment: 10 Ом ± 5 % 0 Вт 0402 RI0402L100JT)
R22  value TBD  Package: 0402  [RESC100X50X40L25N]  (hidden comment: TBD 0402)
R23  value TBD  Package: 0402  [RESC100X50X40L25N]  (hidden comment: TBD 0402)
Z1  FP3P7-814-10  [LCCS110P300X300X146-6N]
Z2  0868LP15A020E  [LCC065P125X200X085-8]

### Nets
+3,6V RFPA_VCC: C32.1 C35.1 C36.1 L3.1 L4.1
GND: C22.1 C23.1 C24.1 C26.2 C27.1 C28.1 C29.1 C30.1 C31.2 C32.2 C33.2 C34.2 C35.2 C36.2 DA1.1(NC) DA1.2(GND) DA1.4(NC) DA1.5(NC) DA1.7(NC) DA1.8(NC) DA1.11(NC) DA1.15(NC) DA1.17(NC) R20.2 R22.2 Z1.1(GND) Z1.3(GND) Z1.4(GND) Z1.6(GND) Z2.1(GND) Z2.2(NC) Z2.3(GND) Z2.5(GND) Z2.6(NC) Z2.7(GND)
PA_A_CTRL: R19.1
PA_G0: R17.1
PA_G1: R18.1
RF_OUT: Z1.2(I/O)
RFPA_G8: C22.2 DA1.12(G8) R17.2
RFPA_G16: C23.2 DA1.13(G16) R18.2
RFPA_VB: C28.2 C30.2 DA1.16(VBIAS) R21.2
RFPA_VPD: C24.2 DA1.6(VPD) R19.2
RFPA_VСС1: C27.2 C29.2 DA1.14(VCC1) L3.2 R21.1
RFSW_OUT: Z2.4(OUT)
NetC25_1: C25.1 Z1.5(I/O)
NetC25_2: C25.2 C26.1 L2.1 R20.1
NetC31_1: C31.1 DA1.9(RF_OUT_/_VCC2) DA1.10(RF_OUT_/_VCC2) L4.2 R22.1 R23.1
NetC33_1: C33.1 C34.1 C37.1 R23.2
NetC37_2: C37.2 Z2.8(IN)
NetDA1_3: DA1.3(RF_IN) L2.2

### Layout directives
net class RF: NetC25_1, NetC31_1, RFSW_OUT

### Notes on the sheet
- Подп. и дата
- Инв. № дубл.
- Взам. инв. №
- Инв. № подл.
- Изм.
- Лист
- № докум.
- Подп.
- Дата
- Копировал
- Формат А3
- (in symbol 0868LP15A020) LPF
- (in symbol FP3P7-***-**) BPF

### Library data of the parts
C22-C25 C27 C28 C32 C35 C37 = C 0402: as C48 on sheet МПСУ.464421.22-01 BBP; PartNumber: GRM1555C1H101JZ01D; Category: Passive; Subcategory: Capacitor; Dielectric: C0G; Status: Approved
C26 C31 C33 C34 C36 = C 0402: as C49 on sheet МПСУ.464421.22-01 BBP; Category: Passive; Subcategory: Capacitor; Status: Approved
C29 C30 = C 0402: as C38 on sheet МПСУ.464421.22-01 BBP; PartNumber: GRM155R61C105KA12D; Category: Passive; Subcategory: Capacitor; Dielectric: X5R; Status: Approved
DA1 = RFPA0133TR7: 380 to 960 MHz, 3 to 5V programmable gain high efficiency power amplifier; Manufacturer: RFD, Qorvo; Designer: Лазба; 3D_Body: +; ComponentLink1Description: Техническое описание; ComponentLink1URL: Q:\Libs\Descriptions_PDF\RFPA0133_data_sheet.pdf; Category: IC; Subcategory: VGA; Status: Check; Package: 16-Lead QFN; PartNumber: RFPA0133TR7
L2 = L 0402: Inductor 0402; Designer: Свидерский; Notes: CP; 3D_Body: +; Tolerance: 0 %; Peak_Condition: 0 А; Category: Passive; Subcategory: Inductor; Status: Approved
L3 L4 = L 0402: as L5 on sheet МПСУ.464421.22-01 BBP; PartNumber: LQG15HNR10J02D; Category: Passive; Subcategory: Inductor; Status: Approved
R17-R19 R21 = R 0402: as R24 on sheet МПСУ.464421.22-01 BBP; Category: Passive; Subcategory: Resistor; Status: Approved
  R17-R19: PartNumber: RI0402L301JT
  R21: PartNumber: RI0402L100JT
R20 R22 R23 = R 0402: as R36 on sheet МПСУ.464421.22-01 BBP; Category: Passive; Subcategory: Resistor; Status: Approved
Z1 = FP3P7-***-**: BandPass Filter; Manufacturer: БУТИС; Designer: Лазба; 3D_Body: +; ComponentLink1Description: Техническое описание; ComponentLink1URL: Q:\Libs\Descriptions_PDF\FP3P7-814-10.pdf; Category: Passive; Subcategory: Filter; Status: Check; Package: SMD 3,0x3,0; PartNumber: FP3P7-814-10
Z2 = 0868LP15A020: 868MHz Center Frequency Low Pass Filter for high frequency ceramic solutions 20MHz Bandwidth 0.5dB 0805 (2012 Metric), 8 PC Pad; Manufacturer: Johanson Technology Inc.; Designer: Лазба; 3D_Body: +; ComponentLink1Description: Техническое описание; ComponentLink1URL: Q:\Libs\Descriptions_PDF\0868LP15A020.pdf; Category: Passive; Subcategory: Filter; Status: Check; PartNumber: 0868LP15A020E

## Sheet МПСУ.464421.22-01 RF_IN.SchDoc
size 297 x 209 mm; Address1: Address1; Address2: Address2; Address3: Address3; Address4: Address4; SheetNumber: 4; SheetTotal: 6; OboznachenieSCH: МПСУ.464421.22-01; DocumentTypeSCH: Э3; DocumentName1SCH: Плата; NachOtdelaSCH: Орешкин; UtverjdenSCH: Утвержден
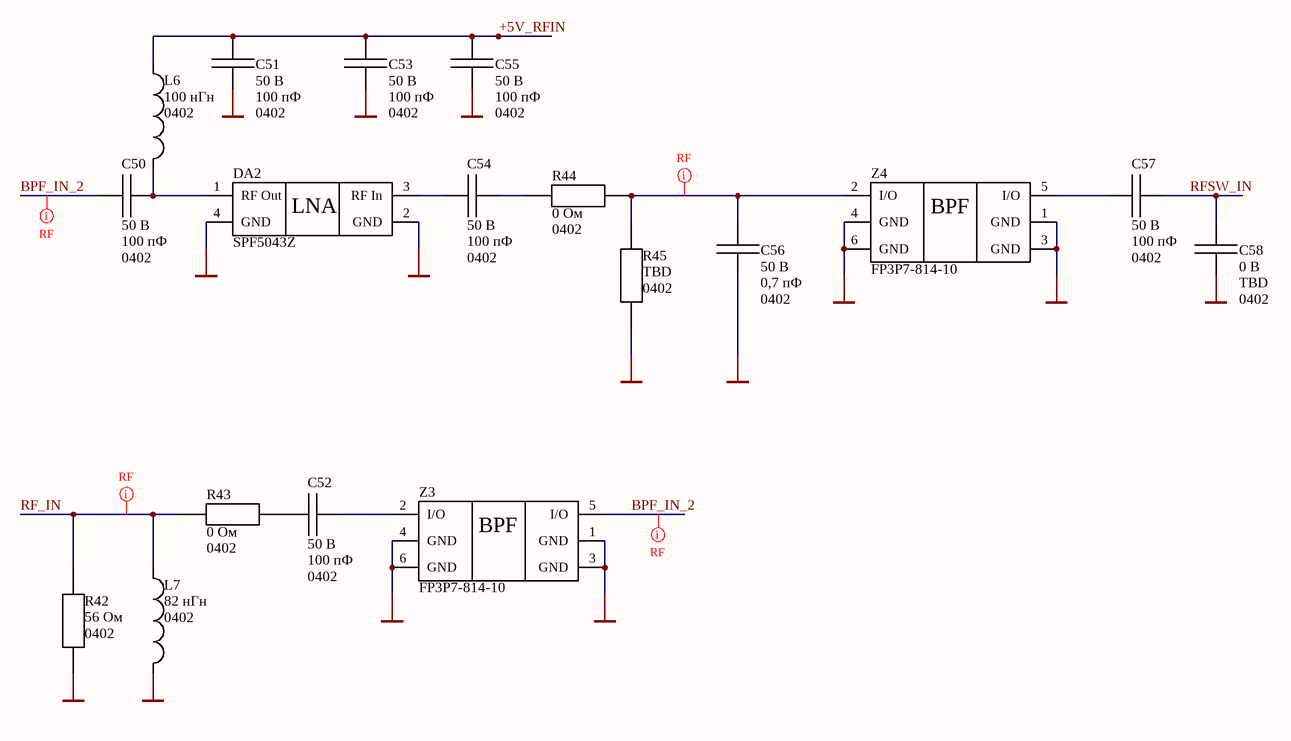
[diagram p3: МПСУ.464421.22-01 RF_IN.SchDoc]

### Parts
C50  value 100 пФ  Peak_Condition: 50 В  Package: 0402  [CAPC100X50X55L20N]  (hidden comment: 100 пФ ± 5 % 50 В C0G 0402 GRM1555C1H101JZ01D)
C51  value 100 пФ  Peak_Condition: 50 В  Package: 0402  [CAPC100X50X55L20N]  (hidden comment: 100 пФ ± 5 % 50 В C0G 0402 GRM1555C1H101JZ01D)
C52  value 100 пФ  Peak_Condition: 50 В  Package: 0402  [CAPC100X50X55L20N]  (hidden comment: 100 пФ ± 5 % 50 В C0G 0402 GRM1555C1H101JZ01D)
C53  value 100 пФ  Peak_Condition: 50 В  Package: 0402  [CAPC100X50X55L20N]  (hidden comment: 100 пФ ± 5 % 50 В C0G 0402 GRM1555C1H101JZ01D)
C54  value 100 пФ  Peak_Condition: 50 В  Package: 0402  [CAPC100X50X55L20N]  (hidden comment: 100 пФ ± 5 % 50 В C0G 0402 GRM1555C1H101JZ01D)
C55  value 100 пФ  Peak_Condition: 50 В  Package: 0402  [CAPC100X50X55L20N]  (hidden comment: 100 пФ ± 5 % 50 В C0G 0402 GRM1555C1H101JZ01D)
C56  value 0,7 пФ  Peak_Condition: 50 В  Package: 0402  [CAPC100X50X55L20N]  (hidden comment: 0,7 пФ ± 0,05 пФ 50 В C0G 0402 GRM1555C1HR70WA01D)
C57  value 100 пФ  Peak_Condition: 50 В  Package: 0402  [CAPC100X50X55L20N]  (hidden comment: 100 пФ ± 5 % 50 В C0G 0402 GRM1555C1H101JZ01D)
C58  value TBD  Peak_Condition: 0 В  Package: 0402  [CAPC100X50X55L20N]  (hidden comment: TBD 0402)
DA2  SPF5043Z  [SOT130P210X100-4N]
L6  value 100 нГн  Package: 0402  [INDC100X50X60L10N]  (hidden comment: 100 нГн ± 5 % 200 мА 0402 LQG15HNR10J02D)
L7  value 82 нГн  Package: 0402  [INDC100X50X60L10N]  (hidden comment: 82 нГн ± 5 % 200 mA 0402 LQG15HN82NJ02D)
R42  value 56 Ом  Package: 0402  [RESC100X50X40L25N]  (hidden comment: 56 Ом ± 1 % 0 Вт 0402 CR-02FL6-56R)
R43  value 0 Ом  Package: 0402  [RESC100X50X40L25N]  (hidden comment: 0 Ом ± 5 % 0 Вт 0402 RI0402L000JT)
R44  value 0 Ом  Package: 0402  [RESC100X50X40L25N]  (hidden comment: 0 Ом ± 5 % 0 Вт 0402 RI0402L000JT)
R45  value TBD  Package: 0402  [RESC100X50X40L25N]  (hidden comment: TBD 0402)
Z3  FP3P7-814-10  [LCCS110P300X300X146-6N]
Z4  FP3P7-814-10  [LCCS110P300X300X146-6N]

### Nets
+5V_RFIN: C51.1 C53.1 C55.1 L6.1
GND: C51.2 C53.2 C55.2 C56.1 C58.2 DA2.2(GND) DA2.4(GND) L7.2 R42.2 R45.2 Z3.1(GND) Z3.3(GND) Z3.4(GND) Z3.6(GND) Z4.1(GND) Z4.3(GND) Z4.4(GND) Z4.6(GND)
BPF_IN_2: C50.1 Z3.5(I/O)
RF_IN: L7.1 R42.1 R43.2
RFSW_IN: C57.2 C58.1
NetC50_2: C50.2 DA2.1(RF_Out) L6.2
NetC52_1: C52.1 R43.1
NetC52_2: C52.2 Z3.2(I/O)
NetC54_1: C54.1 DA2.3(RF_In)
NetC54_2: C54.2 R44.2
NetC56_2: C56.2 R44.1 R45.1 Z4.2(I/O)
NetC57_1: C57.1 Z4.5(I/O)

### Layout directives
net class RF: BPF_IN_2, NetC56_2, RF_IN

### Notes on the sheet
- Подп. и дата
- Инв. № дубл.
- Взам. инв. №
- Инв. № подл.
- Изм.
- Лист
- № докум.
- Подп.
- Дата
- Копировал
- Формат А4
- (in symbol FP3P7-***-**) BPF

### Library data of the parts
C50-C55 C57 = C 0402: as C48 on sheet МПСУ.464421.22-01 BBP; PartNumber: GRM1555C1H101JZ01D; Category: Passive; Subcategory: Capacitor; Dielectric: C0G; Status: Approved
C56 = C 0402: Capacitor 0402; Manufacturer: Murata; Tolerance: 0,05 пФ; Designer: Свидерский; 3D_Body: +; PartNumber: GRM1555C1HR70WA01D; Category: Passive; Subcategory: Capacitor; Dielectric: C0G; Status: Approved
C58 = C 0402: as C49 on sheet МПСУ.464421.22-01 BBP; Category: Passive; Subcategory: Capacitor; Status: Approved
DA2 = SPF5043Z: 50 MHz to 4000 MHz Low-Noise Amplifier; Manufacturer: Qorvo; Designer: Лазба; 3D_Body: +; ComponentLink1Description: Техническое описание; ComponentLink1URL: Q:\Libs\Descriptions_PDF\SPF5043Z Data Sheet.pdf; Category: IC; Subcategory: LNA; Status: Check; Package: SOT343; PartNumber: SPF5043Z
L6 = L 0402: as L5 on sheet МПСУ.464421.22-01 BBP; PartNumber: LQG15HNR10J02D; Category: Passive; Subcategory: Inductor; Status: Approved
L7 = L 0402: Inductor 0402; Manufacturer: Murata; Designer: Свидерский; 3D_Body: +; Tolerance: 5 %; Peak_Condition: 200 mA; PartNumber: LQG15HN82NJ02D; Category: Passive; Subcategory: Inductor; Status: Approved
R42 = R 0402: Resistor 0402; Manufacturer: Viking Tech; Designer: Свидерский; 3D_Body: +; Tolerance: 1 %; Peak_Condition: 0 Вт; PartNumber: CR-02FL6-56R; Category: Passive; Subcategory: Resistor; Status: Approved
R43 R44 = R 0402: as R24 on sheet МПСУ.464421.22-01 BBP; PartNumber: RI0402L000JT; Category: Passive; Subcategory: Resistor; Status: Approved
R45 = R 0402: as R36 on sheet МПСУ.464421.22-01 BBP; Category: Passive; Subcategory: Resistor; Status: Approved
Z3 Z4 = FP3P7-***-**: as Z1 on sheet МПСУ.464421.22-01 RF_OUT; ComponentLink1Description: Техническое описание; ComponentLink1URL: Q:\Libs\Descriptions_PDF\FP3P7-814-10.pdf; Category: Passive; Subcategory: Filter; Status: Check; Package: SMD 3,0x3,0; PartNumber: FP3P7-814-10

## Sheet МПСУ.464421.22-01 Switch,GPS, IO Connectors.SchDoc
size 420 x 297 mm; Address1: Address1; Address2: Address2; Address3: Address3; Address4: Address4; SheetNumber: 5; SheetTotal: 6; OboznachenieSCH: МПСУ.464421.22-01; DocumentTypeSCH: Э3; DocumentName1SCH: Плата; NachOtdelaSCH: Орешкин; UtverjdenSCH: Утвержден
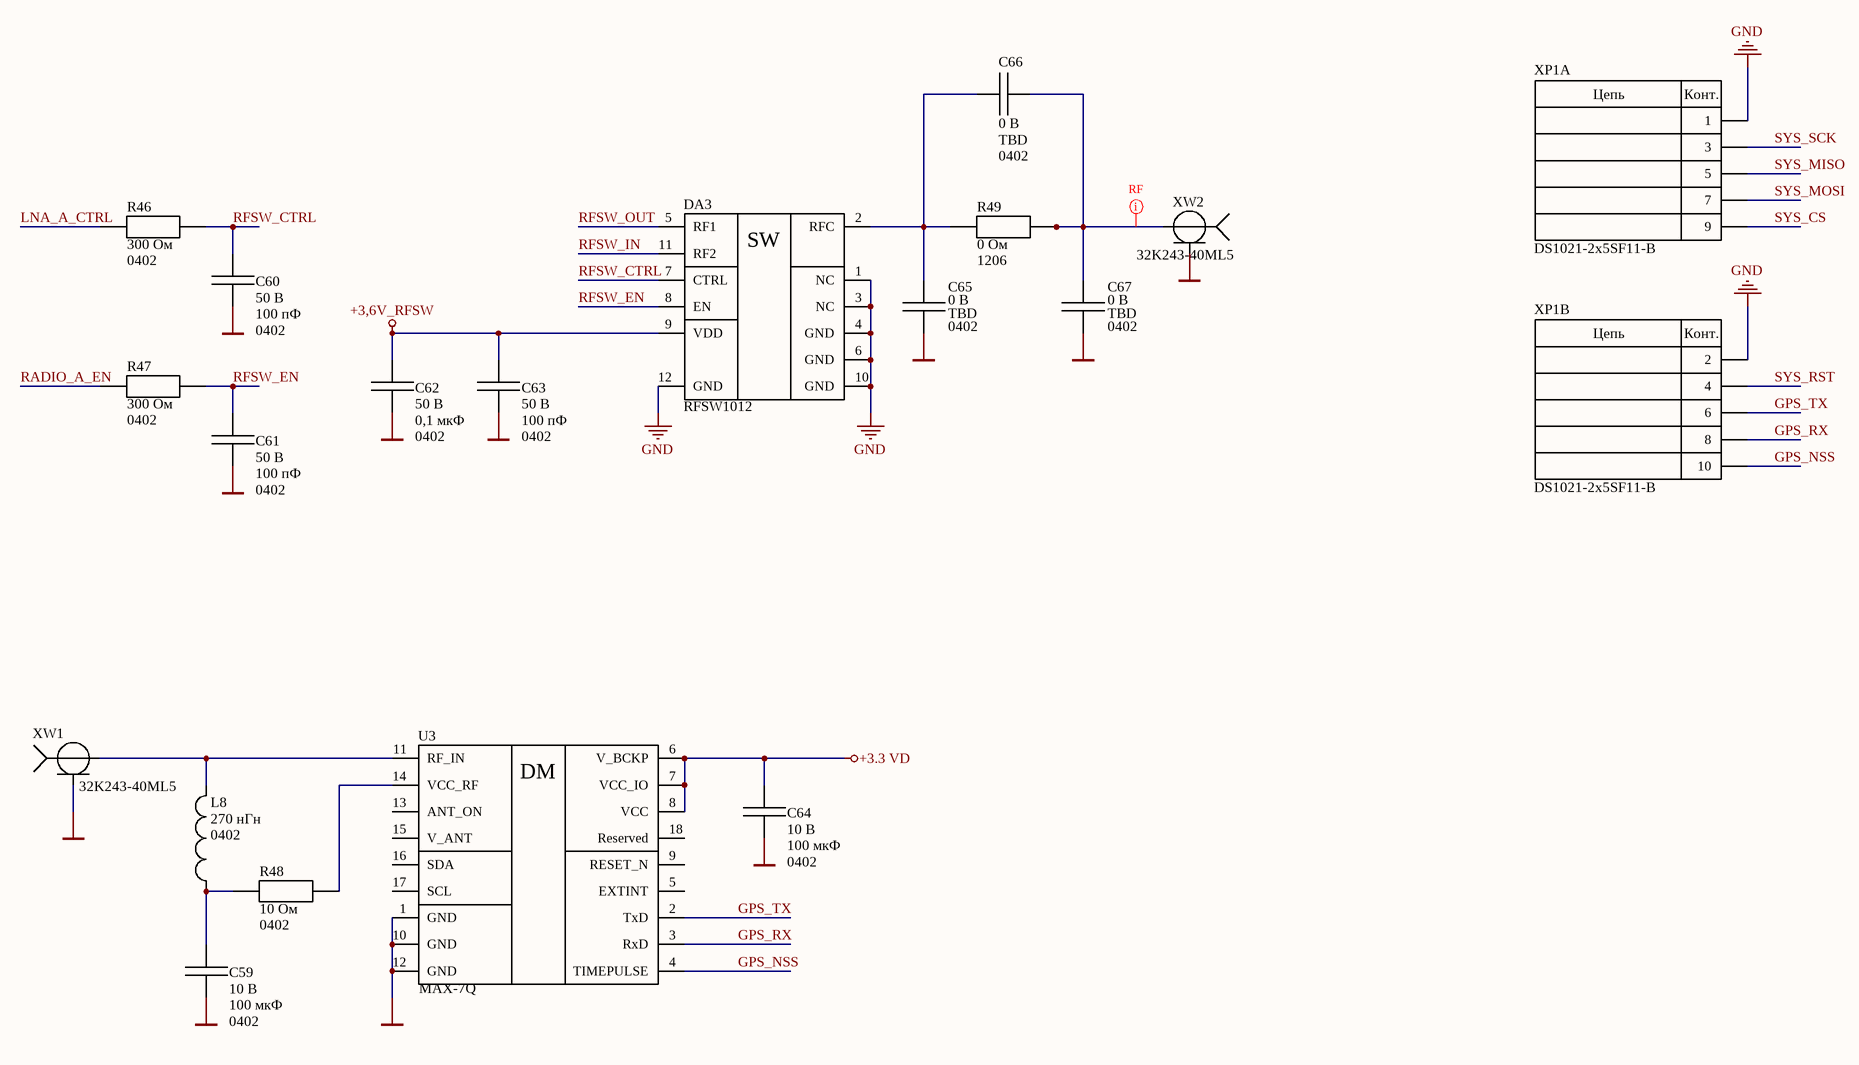
[diagram p4: МПСУ.464421.22-01 Switch,GPS, IO Connectors.SchDoc]

### Parts
C59  value 100 мкФ  Peak_Condition: 10 В  Package: 0402  [CAPC100X50X55L20N]  (hidden comment: 100 мкФ ± 20 % 10 В JB 0402 C3216JB1A107M160AC)
C60  value 100 пФ  Peak_Condition: 50 В  Package: 0402  [CAPC100X50X55L20N]  (hidden comment: 100 пФ ± 5 % 50 В C0G 0402 GRM1555C1H101JZ01D)
C61  value 100 пФ  Peak_Condition: 50 В  Package: 0402  [CAPC100X50X55L20N]  (hidden comment: 100 пФ ± 5 % 50 В C0G 0402 GRM1555C1H101JZ01D)
C62  value 0,1 мкФ  Peak_Condition: 50 В  Package: 0402  [CAPC100X50X55L20N]  (hidden comment: 0,1 мкФ ± 10 % 50 В X7R 0402 GRM155R71H104KE14J)
C63  value 100 пФ  Peak_Condition: 50 В  Package: 0402  [CAPC100X50X55L20N]  (hidden comment: 100 пФ ± 5 % 50 В C0G 0402 GRM1555C1H101JZ01D)
C64  value 100 мкФ  Peak_Condition: 10 В  Package: 0402  [CAPC100X50X55L20N]  (hidden comment: 100 мкФ ± 20 % 10 В JB 0402 C3216JB1A107M160AC)
C65  value TBD  Peak_Condition: 0 В  Package: 0402  [CAPC100X50X55L20N]  (hidden comment: TBD 0402)
C66  value TBD  Peak_Condition: 0 В  Package: 0402  [CAPC100X50X55L20N]  (hidden comment: TBD 0402)
C67  value TBD  Peak_Condition: 0 В  Package: 0402  [CAPC100X50X55L20N]  (hidden comment: TBD 0402)
DA3  RFSW1012  [PQFN50P200X200X60_HS-13N]
L8  value 270 нГн  Package: 0402  [INDC100X50X60L10N]  (hidden comment: 270 нГн ± 5 % 110 мА 0402 LQG15HSR27J02D)
R46  value 300 Ом  Package: 0402  [RESC100X50X40L25N]  (hidden comment: 300 Ом ± 5 % 0 Вт 0402 RI0402L301JT)
R47  value 300 Ом  Package: 0402  [RESC100X50X40L25N]  (hidden comment: 300 Ом ± 5 % 0 Вт 0402 RI0402L301JT)
R48  value 10 Ом  Package: 0402  [RESC100X50X40L25N]  (hidden comment: 10 Ом ± 5 % 0 Вт 0402 RI0402L100JT)
R49  value 0 Ом  Package: 1206  [RESC310X160X55L50N]  (hidden comment: 0 Ом ± 5 % 0 Вт 1206 RI1206L000JT)
U3  MAX-7Q  [MAX-7-Q0]
XP1  DS1021-2x5SF11-B  [HDRV10W64P254_5X2_1270X508H854]  (parts A,B of 2)
XW1  32K243-40ML5  [32K243-40ML5]
XW2  32K243-40ML5  [32K243-40ML5]

### Nets
+3,6V_RFSW: C62.2 C63.2 DA3.9(VDD)  [project net +3,6V RFPA_VCC]
+3.3 VD: C64.1 U3.6(V_BCKP) U3.7(VCC_IO) U3.8(VCC)
GND: C59.2 C60.1 C61.1 C62.1 C63.1 C64.2 C65.1 C67.1 DA3.1(NC) DA3.3(NC) DA3.4(GND) DA3.6(GND) DA3.10(GND) DA3.12(GND) U3.1(GND) U3.10(GND) U3.12(GND) XP1.1 XP1.2 XW1.2(GND) XW2.2(GND)
GPS_NSS: U3.4(TIMEPULSE) XP1.10
GPS_RX: U3.3(RxD) XP1.8
GPS_TX: U3.2(TxD) XP1.6
LNA_A_CTRL: R46.1
RADIO_A_EN: R47.1
RFSW_CTRL: C60.2 DA3.7(CTRL) R46.2
RFSW_EN: C61.2 DA3.8(EN) R47.2
RFSW_IN: DA3.11(RF2)
RFSW_OUT: DA3.5(RF1)
SYS_CS: XP1.9
SYS_MISO: XP1.5
SYS_MOSI: XP1.7
SYS_RST: XP1.4
SYS_SCK: XP1.3
NetC59_1: C59.1 L8.1 R48.1
NetC65_2: C65.2 C66.2 DA3.2(RFC) R49.1
NetC66_1: C66.1 C67.2 R49.2 XW2.1(RF)
NetL8_2: L8.2 U3.11(RF_IN) XW1.1(RF)
NetR48_2: R48.2 U3.14(VCC_RF)

Not connected (* = marked no-connect by the designer): U3 5(EXTINT) 9(RESET_N) 13(ANT_ON) 15(V_ANT) 16(SDA) 17(SCL) 18(Reserved)

### Layout directives
net class RF: NetC66_1

### Notes on the sheet
- Подп. и дата
- Инв. № дубл.
- Взам. инв. №
- Инв. № подл.
- Изм.
- Лист
- № докум.
- Подп.
- Дата
- Копировал
- Формат А3
- (in symbol DS1021-2x5SF11-B, part A) Цепь; Конт.
- (in symbol DS1021-2x5SF11-B, part B) Цепь; Конт.
- (in symbol MAX-7-*) DM
- (in symbol RFSW1012) SW

### Library data of the parts
C59 C64 = C 0402: Capacitor 0402; Manufacturer: TDK; Tolerance: 20 %; Designer: Свидерский; 3D_Body: +; PartNumber: C3216JB1A107M160AC; Category: Passive; Subcategory: Capacitor; Dielectric: JB; Status: Approved
C60 C61 C63 = C 0402: as C48 on sheet МПСУ.464421.22-01 BBP; PartNumber: GRM1555C1H101JZ01D; Category: Passive; Subcategory: Capacitor; Dielectric: C0G; Status: Approved
C62 = C 0402: as C38 on sheet МПСУ.464421.22-01 BBP; PartNumber: GRM155R71H104KE14J; Category: Passive; Subcategory: Capacitor; Dielectric: X7R; Status: Approved
C65-C67 = C 0402: as C49 on sheet МПСУ.464421.22-01 BBP; Category: Passive; Subcategory: Capacitor; Status: Approved
DA3 = RFSW1012: Broadband SPDT Switch 0.005-6 GHz; Manufacturer: Qorvo; Designer: Лазба; 3D_Body: +; ComponentLink1Description: Техническое описание; ComponentLink1URL: Q:\Libs\Descriptions_PDF\RFSW1012 Data Sheet.pdf; Category: IC; Subcategory: Switch; Status: Check; Package: *; PartNumber: RFSW1012
L8 = L 0402: Inductor 0402; Manufacturer: Murata; Designer: Свидерский; 3D_Body: +; Tolerance: 5 %; Peak_Condition: 110 мА; PartNumber: LQG15HSR27J02D; Category: Passive; Subcategory: Inductor; Status: Approved
R46-R48 = R 0402: as R24 on sheet МПСУ.464421.22-01 BBP; Category: Passive; Subcategory: Resistor; Status: Approved
  R46 R47: PartNumber: RI0402L301JT
  R48: PartNumber: RI0402L100JT
R49 = R 1206: Resistor 1206; Manufacturer: Hottech; Designer: Свидерский; 3D_Body: +; Tolerance: 5 %; Peak_Condition: 0 Вт; PartNumber: RI1206L000JT; Category: Passive; Subcategory: Resistor; Status: Approved
U3 = MAX-7-*: GPS/GNSS Module; Manufacturer: u-blox; Designer: Лазба; 3D_Body: +; ComponentLink1Description: Техническое описание; ComponentLink1URL: Q:\Libs\Descriptions_PDF\MAX_7_DataSheet__UBX_13004068_-2010070.pdf; Category: IC; Subcategory: Transciever; Status: Check; PartNumber: MAX-7Q
XP1 = DS1021-2x5SF11-B: Вилка 2,54мм; Manufacturer: Connfly Electronic; 3D_Body: +; Designer: Свидерский; Pitch: 2.54mm; System: Connector; ComponentLink1Description: Техническое описание; ComponentLink1URL: Q:\Libs\Descriptions_PDF\DS1021.pdf; Category: Connector; Subcategory: Male; Pins: 2x5; Status: Approved; PartNumber: DS1021-2x5SF11-B
XW1 XW2 = 32K243-40ML5: RF connector, Right Angle Jack PCB SMA Female End Launch Connector; Manufacturer: Rosenberger; 3D_Body: +; Designer: Шеремет; Pitch: 3.5mm; ComponentLink1Description: Техническое описание; ComponentLink1URL: Q:\Libs\Descriptions_PDF\32K243-40ML5.pdf; Category: Connector; Subcategory: RF; Pins: Coax; Status: Approved; System: Connector; PartNumber: 32K243-40ML5